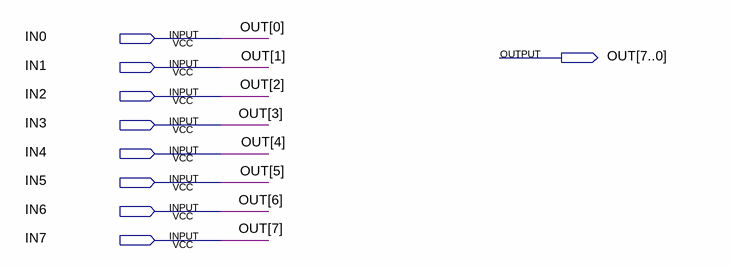
[diagram p0: schematic sheet]
// Quartus schematic in8out1.bdf as structural Verilog: 0 symbols, 9 pins
module in8out1 (
  input  IN0,
  input  IN1,
  input  IN2,
  input  IN3,
  input  IN4,
  input  IN5,
  input  IN6,
  input  IN7,
  output [7:0] OUT
);


  assign OUT = {IN7, IN6, IN5, IN4, IN3, IN2, IN1, IN0};
endmodule
